# EAGLE schematic Power Board Rev A (EAGLE 6.5.0)
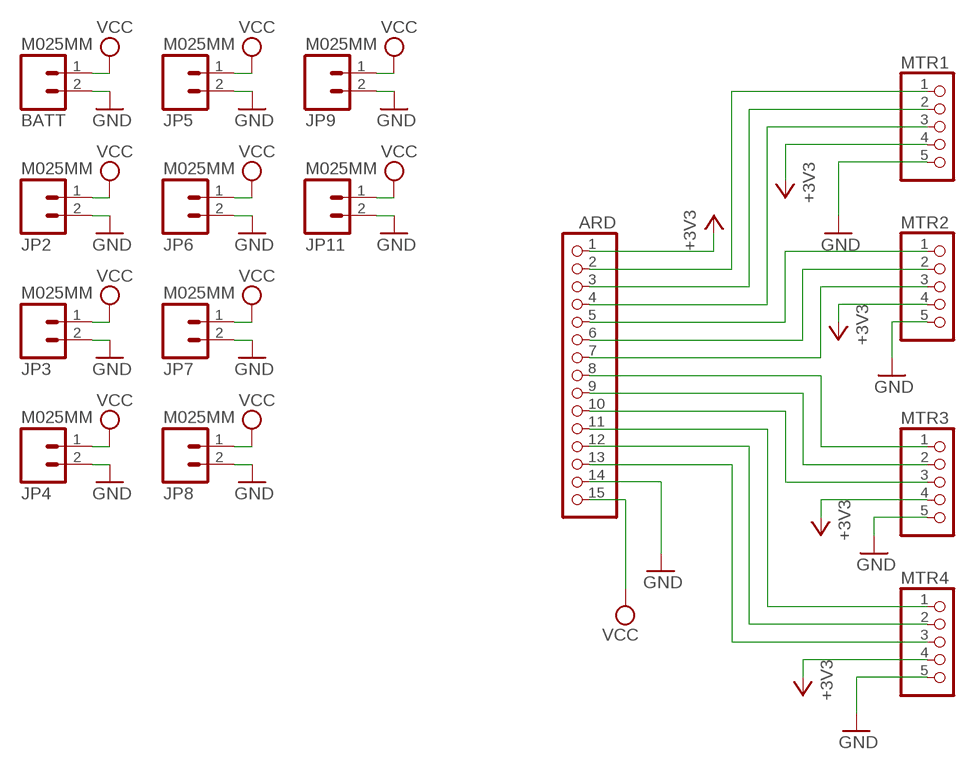
[diagram p0: schematic, sheet 1]

## Parts
ARD  PINHD-1X15  [1X15]
BATT  M025MM  [SCREWTERMINAL-5MM-2]
JP2  M025MM  [SCREWTERMINAL-5MM-2]
JP3  M025MM  [SCREWTERMINAL-5MM-2]
JP4  M025MM  [SCREWTERMINAL-5MM-2]
JP5  M025MM  [SCREWTERMINAL-5MM-2]
JP6  M025MM  [SCREWTERMINAL-5MM-2]
JP7  M025MM  [SCREWTERMINAL-5MM-2]
JP8  M025MM  [SCREWTERMINAL-5MM-2]
JP9  M025MM  [SCREWTERMINAL-5MM-2]
JP11  M025MM  [SCREWTERMINAL-5MM-2]
MTR1  PINHD-1X5  [1X05]
MTR2  PINHD-1X5  [1X05]
MTR3  PINHD-1X5  [1X05]
MTR4  PINHD-1X5  [1X05]

## Nets
+3V3 [Data]: ARD.1 MTR1.4 MTR2.4 MTR3.4 MTR4.4
GND: ARD.14 BATT.2 JP2.2 JP3.2 JP4.2 JP5.2 JP6.2 JP7.2 JP8.2 JP9.2 JP11.2 MTR1.5 MTR2.5 MTR3.5 MTR4.5
N$1 [Data]: ARD.2 MTR1.1
N$2 [Data]: ARD.3 MTR1.2
N$3 [Data]: ARD.4 MTR1.3
N$4 [Data]: ARD.5 MTR2.1
N$5 [Data]: ARD.6 MTR2.2
N$6 [Data]: ARD.7 MTR2.3
N$7 [Data]: ARD.8 MTR3.1
N$8 [Data]: ARD.9 MTR3.2
N$9 [Data]: ARD.10 MTR3.3
N$10 [Data]: ARD.11 MTR4.1
N$11: ARD.12 MTR4.2
N$12 [Data]: ARD.13 MTR4.3
VCC: ARD.15 BATT.1 JP2.1 JP3.1 JP4.1 JP5.1 JP6.1 JP7.1 JP8.1 JP9.1 JP11.1

## Library data of the parts
ARD = pinhead:PINHD-1X15: PIN HEADER
BATT JP2-JP9 JP11 = SparkFun-Connectors:M02: Standard 2-pin 0.1" header. Use with - straight break away headers ( PRT-00116) - right angle break away headers (PRT-00553) - swiss pins (PRT-00743) - machine pins (PRT-00117) - female headers (PRT-00115) Molex polarized connector foot print use with: PRT-08233 with associated crimp pins and housings. 2.54_SCREWTERM for use with PRT-10571. 3.5mm Screw Terminal footprints for PRT-08084 5mm Screw Terminal footprints for use with PRT-08433
MTR1-MTR4 = pinhead:PINHD-1X5: PIN HEADER

## Net classes
0 High Power: width 6.35 mm, drill 8.89 mm, clearance 0.762 mm
1 Data: width 0.381 mm, drill 0.508 mm, clearance 0.254 mm